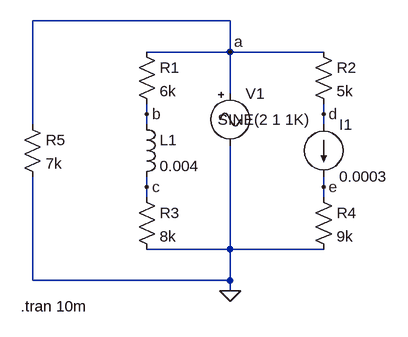
[diagram p0: schematic ooftest4.asc]
ooftest4.asc, the LTspice schematic file:
Version 4
SHEET 1 880 680
WIRE 208 -48 -96 -48
WIRE 208 0 208 -48
WIRE 208 0 80 0
WIRE 352 0 208 0
WIRE 208 64 208 0
WIRE 80 96 80 80
WIRE 352 96 352 80
WIRE -96 112 -96 -48
WIRE 80 112 80 96
WIRE 352 112 352 96
WIRE 80 208 80 192
WIRE 352 208 352 192
WIRE 80 224 80 208
WIRE 352 224 352 208
WIRE 208 304 208 144
WIRE 208 304 80 304
WIRE 352 304 208 304
WIRE -96 352 -96 192
WIRE 208 352 208 304
WIRE 208 352 -96 352
WIRE 208 368 208 352
FLAG 208 368 0
FLAG 208 0 a
FLAG 80 96 b
FLAG 80 208 c
FLAG 352 208 e
FLAG 352 96 d
SYMBOL current 352 112 R0
SYMATTR InstName I1
SYMATTR Value 0.0003
SYMBOL res 64 -16 R0
SYMATTR InstName R1
SYMATTR Value 6k
SYMBOL res 336 -16 R0
SYMATTR InstName R2
SYMATTR Value 5k
SYMBOL res 64 208 R0
SYMATTR InstName R3
SYMATTR Value 8k
SYMBOL res 336 208 R0
SYMATTR InstName R4
SYMATTR Value 9k
SYMBOL res -112 96 R0
SYMATTR InstName R5
SYMATTR Value 7k
SYMBOL Misc\\signal 208 48 R0
WINDOW 3 -19 56 Left 2
SYMATTR InstName V1
SYMATTR Value SINE(2 1 1K)
SYMBOL ind 64 96 R0
SYMATTR InstName L1
SYMATTR Value 0.004
TEXT -114 392 Left 2 !.tran 10m

The netlist it stands for:
* ooftest4.asc
I1 d e 0.0003
R1 a b 6k
R2 a d 5k
R3 c 0 8k
R4 e 0 9k
R5 a 0 7k
V1 a 0 SINE(2 1 1K)
L1 b c 0.004
.tran 10m
.backanno
.end

* Results of the author's LTspice run, read from the files saved beside the schematic
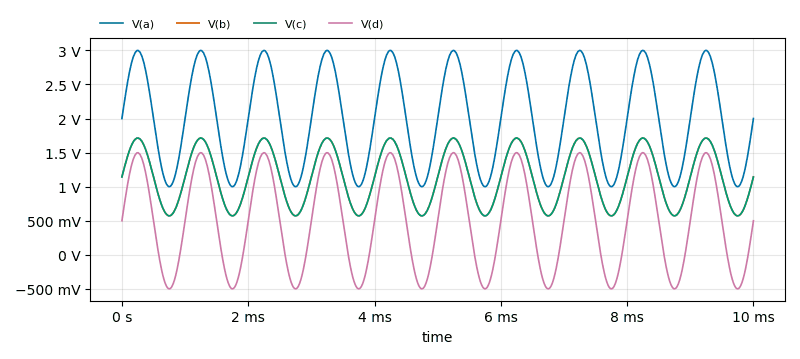
[diagram p1: Transient Analysis of ooftest4.asc, plotted from the saved traces]
* Transient Analysis, 1 run:
*   V(a): min 1 V, max 3 V, average 1.999 V, rms 2.121 V, last 2 V
*   V(b): min 572 mV, max 1.714 V, average 1.142 V, rms 1.212 V, last 1.144 V
*   V(c): min 572 mV, max 1.714 V, average 1.142 V, rms 1.212 V, last 1.142 V
*   V(d): min -499 mV, max 1.499 V, average 499.2 mV, rms 866.5 mV, last 500 mV